# Altium schematic sheet InterfaceConfiguracao.SchDoc: CONTROLADORA AIRPOPCORN
size A3; DocumentNumber: 10.00.0025; SheetNumber: 9; SheetTotal: 16
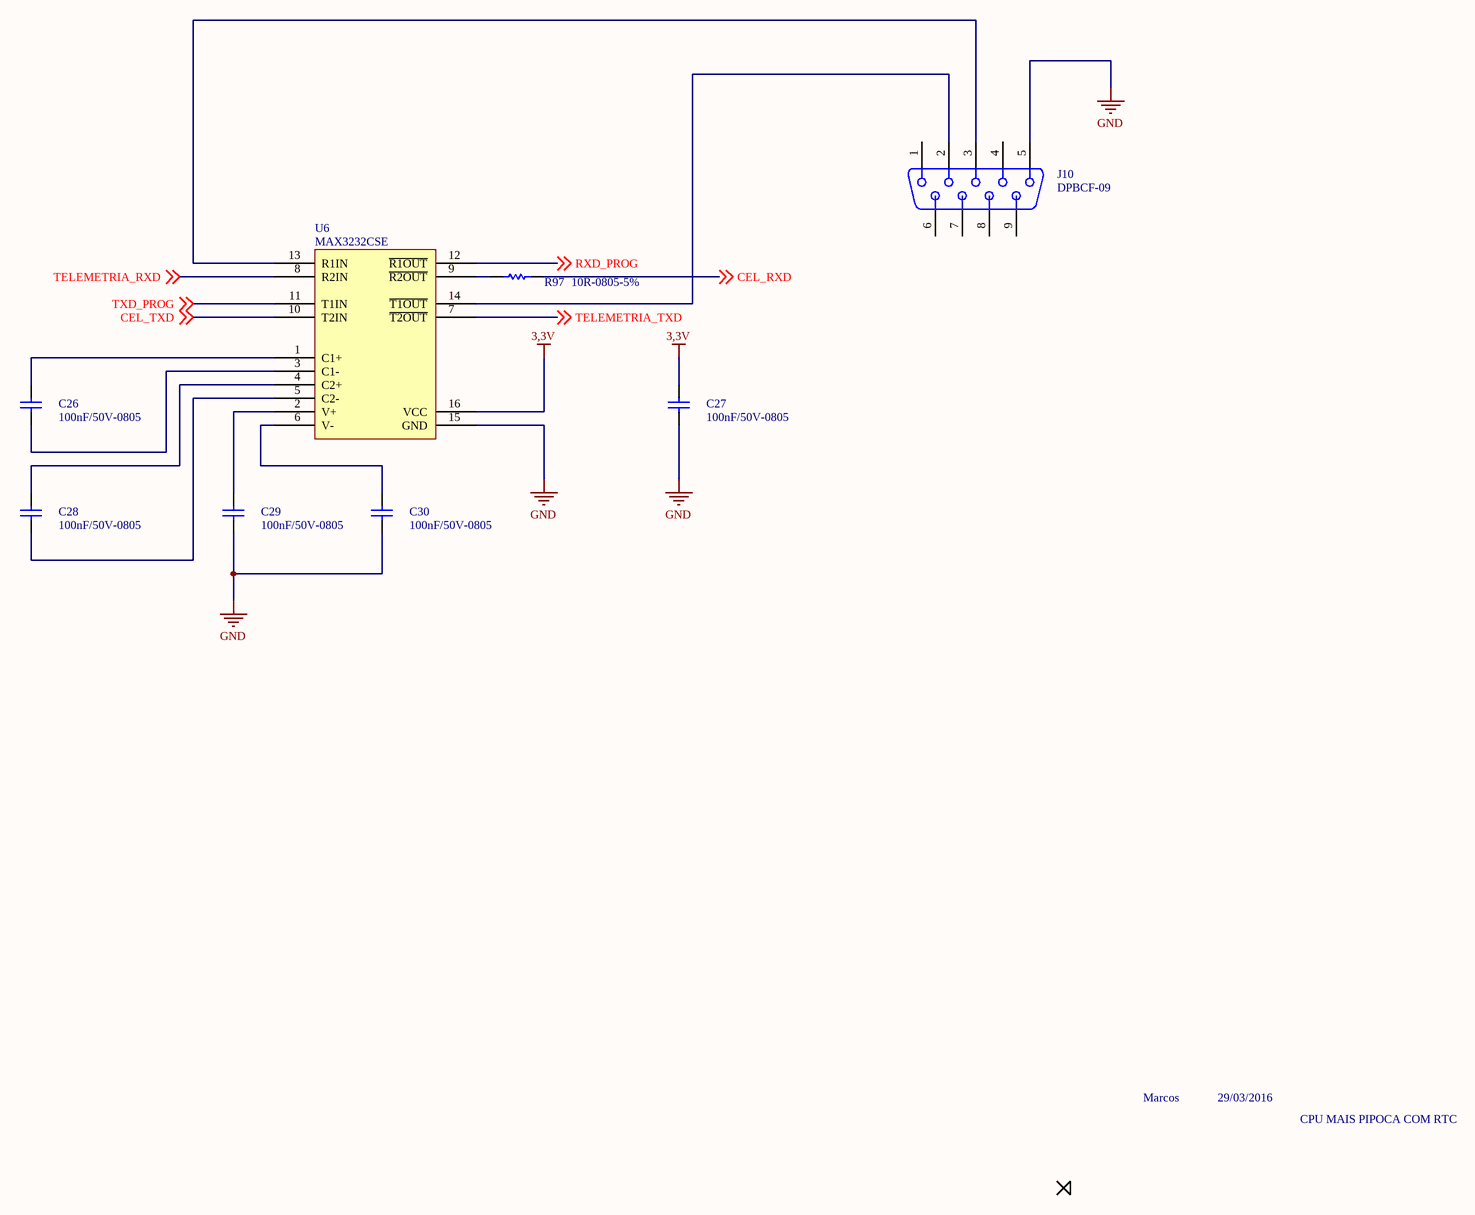
[diagram p0: InterfaceConfiguracao.SchDoc]

## Parts
C26  100nF/50V-0805  [0805-REVISADO O]
C27  100nF/50V-0805  [0805-REVISADO O]
C28  100nF/50V-0805  [0805-REVISADO O]
C29  100nF/50V-0805  [0805-REVISADO O]
C30  100nF/50V-0805  [0805-REVISADO O]
J10  DPBCF-09  [DB9-FÊMEA MONTA_DB9-FÊMEA_MONTAGEM_EM_PCI_180(Primary)]
R97  10R-0805-5%  [0805-REVISADO O]
U6  MAX3232CSE  [SOIC 16 PINOS]

## Nets
3,3V: C27.2 U6.16(VCC)
GND: C27.1 C29.1 C30.1 J10.5 U6.15(GND)
CEL_RXD: R97.2 ; off-sheet CEL_RXD
CEL_TXD: U6.10(T2IN) ; off-sheet CEL_TXD
RXD_PROG: U6.12(~{R1OUT}) ; off-sheet RXD_PROG
TELEMETRIA_RXD: U6.8(R2IN) ; off-sheet TELEMETRIA_RXD
TELEMETRIA_TXD: U6.7(~{T2OUT}) ; off-sheet TELEMETRIA_TXD
TXD_PROG: U6.11(T1IN) ; off-sheet TXD_PROG
NetC26_1: C26.1 U6.3(C1-)
NetC26_2: C26.2 U6.1(C1+)
NetC28_1: C28.1 U6.5(C2-)
NetC28_2: C28.2 U6.4(C2+)
NetC29_2: C29.2 U6.2(V+)
NetC30_2: C30.2 U6.6(V-)
NetJ10_2: J10.2 U6.14(~{T1OUT})
NetJ10_3: J10.3 U6.13(R1IN)
NetR97_1: R97.1 U6.9(~{R2OUT})

Not connected (* = marked no-connect by the designer): J10 1 4 6 7 8 9

## Notes on the sheet
- Marcos
- 29/03/2016
- CPU MAIS PIPOCA COM RTC
- NOME
- DATA
- PROJETO
- DESCRIÇÃO
- www.quarktee.com.br
- desenho
- verif.
- aprov.
- TAMANHO
- CODIGO
- Todas as informações disponíveis
- não devem ser divulgadas,
- em parte ou todo.
- CIRCUITO IMPRESSO
- MONTAGEM ELETRÔNICA
- A4
- de

## Library data of the parts
C26-C30 = 100nF/50-0805-NPO: ERP: 104.11.005
J10 = DB-9 - FÊMEA 180º MONTAGEM EM PCI: DBPCF-09; ERP: 434.00.002
R97 = 10R-0805-5%: ERP: 102.11.019
U6 = MAX3232CSE: ERP: 110.02.001